# Altium project Smart Ring_2022.PrjPCB
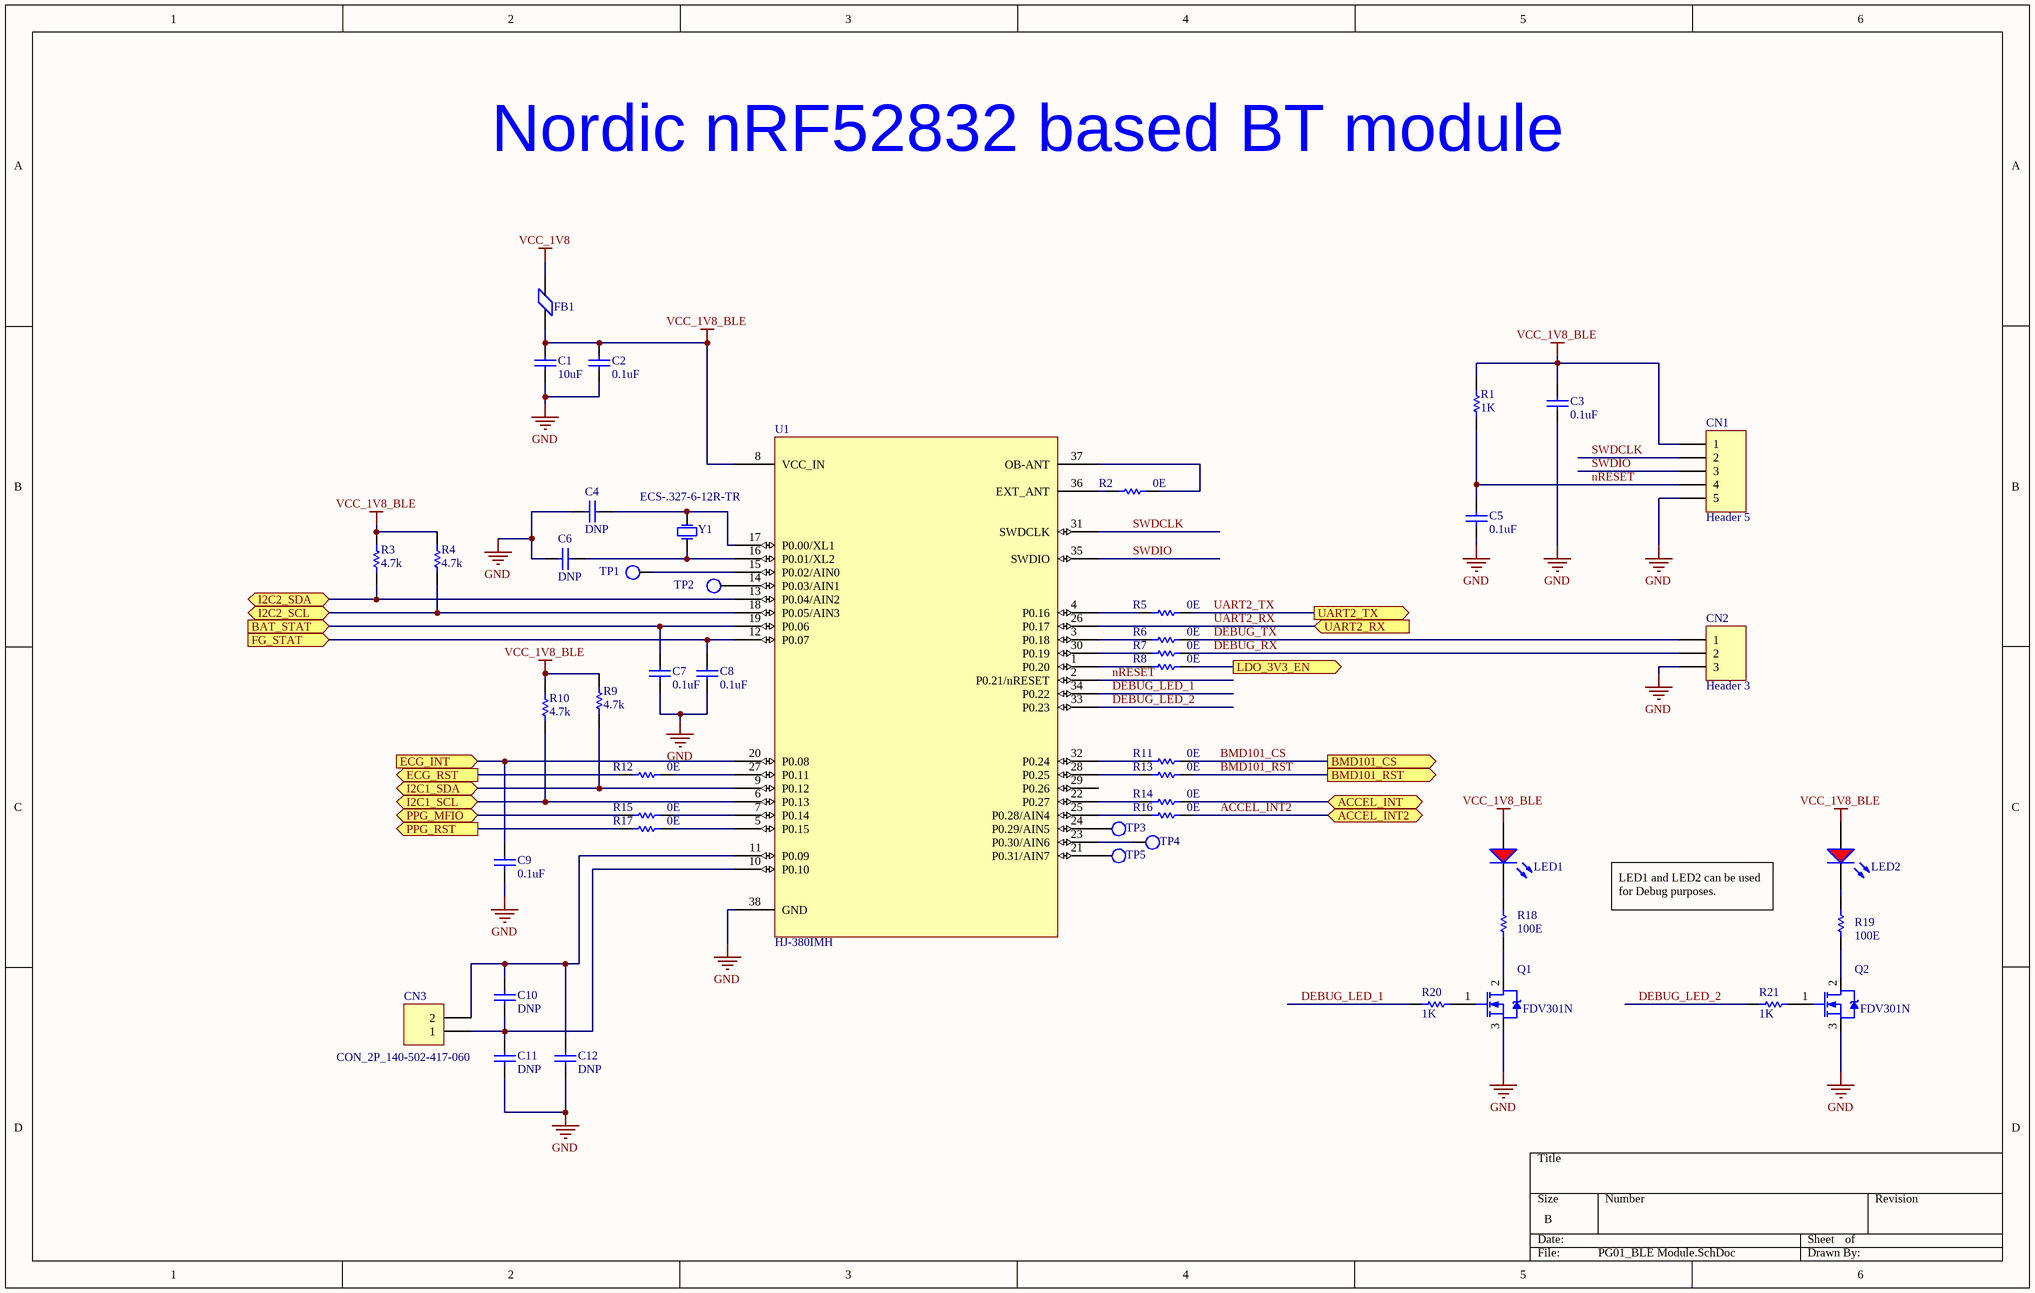
[diagram p0: PG01_BLE Module.SchDoc]
6 sheets, 221 parts. Net scope: flat (ports and power ports of the same name join across sheets).
Board file: PCB1_Bhavik.PcbDoc
Sheets:
  PG01_BLE Module.SchDoc
  PG02_PPG.SchDoc
  PG03_ECG.SchDoc
  PG04_Battery Charging.SchDoc
  PG05_Power Conversions.SchDoc
  PG06_Nuerosky.SchDoc

## Sheet PG01_BLE Module.SchDoc: Smart Ring (Concept)
size B; DocumentNumber: 1; SheetNumber: 1; SheetTotal: 3

### Parts
C1  10uF  [0805C]
C2  0.1uF  [0402C]
C3  0.1uF  [0402C]
C4  DNP  [0402C]
C5  0.1uF  [0402C]
C6  DNP  [0402C]
C7  0.1uF  [0402C]
C8  0.1uF  [0402C]
C9  0.1uF  [0402C]
C10  DNP  [0402C]
C11  DNP  [0402C]
C12  DNP  [0402C]
CN1  Header 5  [HDR1X5]
CN2  Header 3  [HDR1X3]
CN3  CON_2P_140-502-417-060  [140-502-417-060]
FB1  Ferrite Bead  [0402R]  (value not drawn)
LED1  5988A10107F  [0402R]  (value not drawn)
LED2  5988A10107F  [0402R]  (value not drawn)
Q1  FDV301N  [SOT_23]
Q2  FDV301N  [SOT_23]
R1  1K  [0402R]
R2  0E  [0402R]
R3  4.7k  [0402R]
R4  4.7k  [0402R]
R5  0E  [0402R]
R6  0E  [0402R]
R7  0E  [0402R]
R8  0E  [0402R]
R9  4.7k  [0402R]
R10  4.7k  [0402R]
R11  0E  [0402R]
R12  0E  [0402R]
R13  0E  [0402R]
R14  0E  [0402R]
R15  0E  [0402R]
R16  0E  [0402R]
R17  0E  [0402R]
R18  100E  [0402R]
R19  100E  [0402R]
R20  1K  [0402R]
R21  1K  [0402R]
TP1  Test_Point  [TP]  (value not drawn)
TP2  Test_Point  [TP]  (value not drawn)
TP3  Test_Point  [TP]  (value not drawn)
TP4  Test_Point  [TP]  (value not drawn)
TP5  Test_Point  [TP]  (value not drawn)
U1  HJ-380IMH  [HJ-380IMH]
Y1  ECS-.327-6-12R-TR  [ECS-.327-6-12R-TR]

### Ports
ACCEL_INT2 (bidir), ACCEL_INT (bidir), BAT_STAT (in), BMD101_CS (out), BMD101_RST (out), ECG_INT (in), ECG_RST (out), FG_STAT (in), I2C1_SCL (bidir), I2C1_SDA (bidir), I2C2_SCL (bidir), I2C2_SDA (bidir), LDO_3V3_EN (out), PPG_MFIO (bidir), PPG_RST (out), UART2_RX (in), UART2_TX (out)

### Nets
GND: C1.1 C2.1 C3.2 C4.2 C5.2 C6.2 C7.1 C8.1 C9.1 C11.1 C12.1 CN1.5 CN2.3 Q1.3(S) Q2.3(S) U1.38(GND)
VCC_1V8: FB1.2(VREF)
VCC_1V8_BLE: C1.2 C2.2 C3.1 CN1.1 FB1.1(VREF) LED1.1(A) LED2.1(A) R1.2 R3.2 R4.2 R9.2 R10.2 U1.8(VCC_IN)
ACCEL_INT: R14.2 ; port ACCEL_INT
ACCEL_INT2: R16.2 ; port ACCEL_INT2
BMD101_CS: R11.2 ; port BMD101_CS
BMD101_RST: R13.2 ; port BMD101_RST
DEBUG_LED_1: R20.1 U1.34(P0.22)
DEBUG_LED_2: R21.1 U1.33(P0.23)
DEBUG_RX: CN2.2 R7.2
DEBUG_TX: CN2.1 R6.2
nRESET: C5.1 CN1.4 R1.1 U1.2(P0.21/nRESET)
SWDCLK: CN1.2 U1.31(SWDCLK)
SWDIO: CN1.3 U1.35(SWDIO)
UART2_RX: U1.26(P0.17) ; port UART2_RX
UART2_TX: R5.2 ; port UART2_TX
NetC4_1: C4.1 U1.17(P0.00/XL1) Y1.2(OSC2)
NetC6_1: C6.1 U1.16(P0.01/XL2) Y1.1(OSC1)
NetC7_2: C7.2 U1.19(P0.06) ; port BAT_STAT
NetC8_2: C8.2 U1.12(P0.07) ; port FG_STAT
NetC9_2: C9.2 U1.20(P0.08) ; port ECG_INT
NetC10_1: C10.1 C11.2 CN3.1 U1.10(P0.10)
NetC10_2: C10.2 C12.2 CN3.2 U1.11(P0.09)
NetC23_2: R17.1 ; port PPG_RST
NetC24_2: R15.1 ; port PPG_MFIO
NetC45_2: R12.1 ; port ECG_RST
NetLED1_2: LED1.2(K) R18.2
NetLED2_2: LED2.2(K) R19.2
NetQ1_1: Q1.1(G) R20.2
NetQ1_2: Q1.2(D) R18.1
NetQ2_1: Q2.1(G) R21.2
NetQ2_2: Q2.2(D) R19.1
NetR2_1: R2.1 U1.36(EXT_ANT)
NetR2_2: R2.2 U1.37(OB-ANT)
NetR3_1: R3.1 U1.13(P0.04/AIN2) ; port I2C2_SDA
NetR4_1: R4.1 U1.18(P0.05/AIN3) ; port I2C2_SCL
NetR5_1: R5.1 U1.4(P0.16)
NetR6_1: R6.1 U1.3(P0.18)
NetR7_1: R7.1 U1.30(P0.19)
NetR8_1: R8.1 U1.1(P0.20)
NetR8_2: R8.2 ; port LDO_3V3_EN
NetR9_1: R9.1 U1.9(P0.12) ; port I2C1_SDA
NetR10_1: R10.1 U1.6(P0.13) ; port I2C1_SCL
NetR11_1: R11.1 U1.32(P0.24)
NetR12_2: R12.2 U1.27(P0.11)
NetR13_1: R13.1 U1.28(P0.25)
NetR14_1: R14.1 U1.22(P0.27)
NetR15_2: R15.2 U1.7(P0.14)
NetR16_1: R16.1 U1.25(P0.28/AIN4)
NetR17_2: R17.2 U1.5(P0.15)
NetTP1_1: TP1.1 U1.15(P0.02/AIN0)
NetTP2_1: TP2.1 U1.14(P0.03/AIN1)
NetTP3_1: TP3.1 U1.24(P0.29/AIN5)
NetTP4_1: TP4.1 U1.23(P0.30/AIN6)
NetTP5_1: TP5.1 U1.21(P0.31/AIN7)

Not connected (* = marked no-connect by the designer): U1 29(P0.26)

### Notes on the sheet
- Nordic nRF52832 based BT module
- LED1 and LED2 can be used for Debug purposes.

### Library data of the parts
C1 = CAP_0805_10uF_16V: CAP CER 10UF 16V X7R 0805; Alternate MFR: Taiyo Yuden; Alternate MPN: EMK212BB7106MG-T; Package: 0805; Value: 10uF
C2 C3 C5 C7-C9 = CAP_0402_0.1uF_50V: CAP CER 0.1UF 50V X7R 0402; Alternate MFR: Samsung Electro-Mechanics; Alternate MPN: CL05B104KB54PNC; Package: 0402; Value: 0.1uF
C4 C6 C10-C12 = CAP_0402_DNP: CAP CER DNP 0402; MFR: Generic; MPN: Generic; Package: 0402; Value: DNP
CN1 = CON_5P_CI0105M1HR0-NH: 5 POS 2.00MM(.079) SINGLE ROW SM; MFR: Cvilux USA; MPN: CI0105M1HR0-NH
CN2 = CON_3P_CI0103M1HR0-NH: 3 POS 2.00MM(.079) SINGLE ROW SM; MFR: Cvilux USA; MPN: CI0103M1HR0-NH
CN3 = CON_2P_140-502-417-060: 2.0MM PITCH CONNECTOR WITH 2 SUR; MFR: EDAC Inc.; MPN: 140-502-417-060
FB1 = Ferrite Bead: CHIP BEAD 600 OHM 0402 300mA; MFR: Walsin; MPN: WLBD1005K2U601TP; Package: 0402
LED1 LED2 = LED_Red: Red LED; MFR: Dialight; Forward Voltage: 1.6V; Value: Red; Package: 0402; MPN: 5988A10107F
Q1 Q2 = NMOS_FDV301N: MOSFET N-CH 25V 220MA SOT23; MFR: onsemi; ComponentLink1Description: Manufacturer Link; ComponentLink1URL: http://www.irf.com/; MPN: FDV301N; Package: SOT23
R1 R20 R21 = RES_0402_1k: RES SMD 1K OHM 1% 1/16W 0402; MFR: Generic; Alternate MFR: YAGEO; Alternate MPN: AC0402FR-071KL; MPN: Generic; Package: 0402; Value: 1K
R2 R5-R8 R11-R17 = RES_0402_0E: RES 0 OHM JUMPER 1/16W 0402; MFR: Generic; Alternate MFR: YAGEO; Alternate MPN: AC0402JR-130RL; MPN: Generic; Package: 0402; Value: 0E
R3 R4 R9 R10 = RES_0402_4.7k: RES 4.7K OHM 1% 1/16W 0402; MFR: Generic; Alternate MFR: YAGEO; Alternate MPN: RC0402FR-134K7L; MPN: Generic; Package: 0402; Value: 4.7k
R18 R19 = RES_0402_100E: RES 100 OHM 1% 1/16W 0402; MFR: Generic; Alternate MFR: YAGEO; Alternate MPN: RC0402FR-13100RL; MPN: Generic; Package: 0402; Value: 100E
U1 = BLE Module_HJ-380IMH: Chip-scale high performance ultra small (5.5mmX6mm) ultra low power / Bluetooth 5.0 module based on Nordic nRF52832; MFR: TangShan HongJia Electronic Technology Co., Ltd; MPN: HJ-380IMH
Y1 = XTAL_32.768kHz: CRYSTAL 32.7680KHZ 6PF SMD; MFR: ECS Inc.; MPN: ECS-.327-6-12R-TR; Capacitance: 6pF; Value: 32.768kHz

## Sheet PG02_PPG.SchDoc: Smart Ring (Concept)
size B; DocumentNumber: 2; Revision: A; SheetNumber: 2; SheetTotal: 3
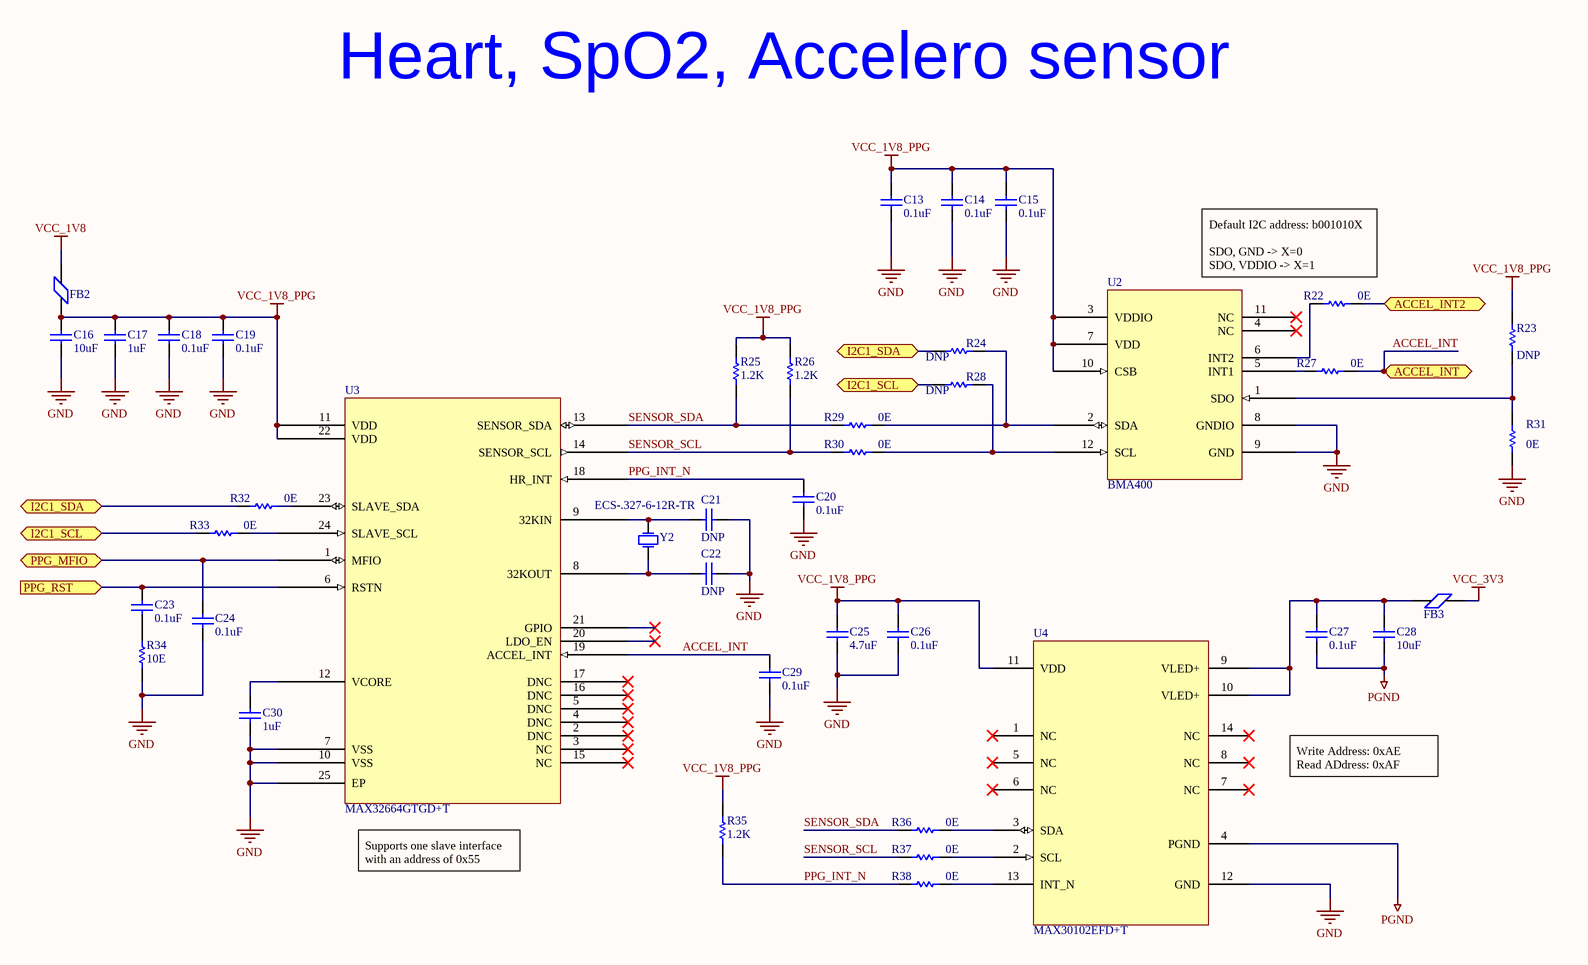
[diagram p1: PG02_PPG.SchDoc]

### Parts
C13  0.1uF  [0402C]
C14  0.1uF  [0402C]
C15  0.1uF  [0402C]
C16  10uF  [0805C]
C17  1uF  [0805C]
C18  0.1uF  [0402C]
C19  0.1uF  [0402C]
C20  0.1uF  [0402C]
C21  DNP  [0402C]
C22  DNP  [0402C]
C23  0.1uF  [0402C]
C24  0.1uF  [0402C]
C25  4.7uF  [0805C]
C26  0.1uF  [0402C]
C27  0.1uF  [0402C]
C28  10uF  [0805C]
C29  0.1uF  [0402C]
C30  1uF  [0805C]
FB2  Ferrite Bead  [0402R]  (value not drawn)
FB3  Ferrite Bead  [0402R]  (value not drawn)
R22  0E  [0402R]
R23  DNP  [0402C]
R24  DNP  [0402C]
R25  1.2K  [0402R]
R26  1.2K  [0402R]
R27  0E  [0402R]
R28  DNP  [0402C]
R29  0E  [0402R]
R30  0E  [0402R]
R31  0E  [0402R]
R32  0E  [0402R]
R33  0E  [0402R]
R34  10E  [0402R]
R35  1.2K  [0402R]
R36  0E  [0402R]
R37  0E  [0402R]
R38  0E  [0402R]
U2  BMA400  [BMA400]
U3  MAX32664GTGD+T  [MAX32664GTGA+T]
U4  MAX30102EFD+T  [MAX30101EFD+T]
Y2  ECS-.327-6-12R-TR  [ECS-.327-6-12R-TR]

### Ports
ACCEL_INT2 (bidir), ACCEL_INT (bidir), I2C1_SCL (bidir), I2C1_SDA (bidir), PPG_MFIO (bidir), PPG_RST (in)

### Nets
GND: C13.1 C14.1 C15.1 C16.1 C17.1 C18.1 C19.1 C20.1 C21.1 C22.1 C24.1 C25.1 C26.1 C29.1 C30.1 R31.1 R34.1 U2.8(GNDIO) U2.9(GND) U3.7(VSS) U3.10(VSS) U3.25(EP) U4.12(GND)
PGND: C27.1 C28.1 U4.4(PGND)
VCC_1V8: FB2.2(VREF)
VCC_1V8_PPG: C13.2 C14.2 C15.2 C16.2 C17.2 C18.2 C19.2 C25.2 C26.2 FB2.1(VREF) R23.2 R25.2 R26.2 R35.2 U2.3(VDDIO) U2.7(VDD) U2.10(CSB) U3.11(VDD) U3.22(VDD) U4.11(VDD)
VCC_3V3: FB3.2(VREF)
ACCEL_INT: C29.2 R27.2 U3.19(ACCEL_INT) ; port ACCEL_INT
ACCEL_INT2: R22.2 ; port ACCEL_INT2
PPG_INT_N: C20.2 R35.1 R38.1 U3.18(HR_INT)
SENSOR_SCL: R26.1 R30.1 R37.1 U3.14(SENSOR_SCL)
SENSOR_SDA: R25.1 R29.1 R36.1 U3.13(SENSOR_SDA)
NetC21_2: C21.2 U3.9(32KIN) Y2.2(OSC2)
NetC22_2: C22.2 U3.8(32KOUT) Y2.1(OSC1)
NetC23_1: C23.1 R34.2
NetC23_2: C23.2 U3.6(RSTN) ; port PPG_RST
NetC24_2: C24.2 U3.1(MFIO) ; port PPG_MFIO
NetC27_2: C27.2 C28.2 FB3.1(VREF) U4.9(VLED+) U4.10(VLED+)
NetC30_2: C30.2 U3.12(VCORE)
NetR9_1: R24.2 R32.1 ; port I2C1_SDA
NetR10_1: R28.2 R33.1 ; port I2C1_SCL
NetR22_1: R22.1 U2.6(INT2)
NetR23_1: R23.1 R31.2 U2.1(SDO)
NetR24_1: R24.1 R29.2 U2.2(SDA)
NetR27_1: R27.1 U2.5(INT1)
NetR28_1: R28.1 R30.2 U2.12(SCL)
NetR32_2: R32.2 U3.23(SLAVE_SDA)
NetR33_2: R33.2 U3.24(SLAVE_SCL)
NetR36_2: R36.2 U4.3(SDA)
NetR37_2: R37.2 U4.2(SCL)
NetR38_2: R38.2 U4.13(INT_N)

Not connected (* = marked no-connect by the designer): U2 4(NC)* 11(NC)*; U3 2(DNC)* 3(NC)* 4(DNC)* 5(DNC)* 15(NC)* 16(DNC)* 17(DNC)* 20(LDO_EN)* 21(GPIO)*; U4 1(NC)* 5(NC)* 6(NC)* 7(NC)* 8(NC)* 14(NC)*

### Notes on the sheet
- Heart, SpO2, Accelero sensor
- Default I2C address: b001010X
  SDO, GND -> X=0
  SDO, VDDIO -> X=1
- Write Address: 0xAE
  Read ADdress: 0xAF
- (near U3) Supports one slave interface with an address of 0x55

### Library data of the parts
C13-C15 C18-C20 C23 C24 C26 C27 C29 = CAP_0402_0.1uF_50V: as C2 on sheet PG01_BLE Module; Package: 0402; Value: 0.1uF
C16 C28 = CAP_0805_10uF_16V: as C1 on sheet PG01_BLE Module; Package: 0805; Value: 10uF
C17 C30 = CAP_0805_1uF_25V: CAP CER 1UF 25V X7R 0805; Alternate MFR: Würth Elektronik; Alternate MPN: 885012207078; Package: 0805; Value: 1uF
C21 C22 = CAP_0402_DNP: CAP CER DNP 0402; MFR: Generic; MPN: Generic; Package: 0402; Value: DNP
C25 = CAP_0805_4.7uF_16V: CAP CER MLCC 4.7uF X7R 16V  0805; Alternate MFR: Murata Electronics; Alternate MPN: GRM21BR71C475ME51K; Package: 0805; Value: 4.7uF
FB2 FB3 = Ferrite Bead: as FB1 on sheet PG01_BLE Module; Package: 0402
R22 R27 R29-R33 R36-R38 = RES_0402_0E: as R2 on sheet PG01_BLE Module; MPN: Generic; Package: 0402; Value: 0E
R23 R24 R28 = RES_0402_DNP: RES DNP 0402; Package: 0402; Value: DNP
R25 R26 R35 = RES_0402_1.2k: RES 1.2K OHM 1% 1/16W 0402; MFR: Generic; Alternate MFR: YAGEO; Alternate MPN: RC0402FR-071K2L; MPN: Generic; Package: 0402; Value: 1.2K
R34 = RES_0402_10E: RES 10 OHM 1% 1/16W 0402; MFR: Generic; Alternate MFR: YAGEO; Alternate MPN: RC0402FR-1310RL; MPN: Generic; Package: 0402; Value: 10E
U2 = AccSensor_BMA400: ACCELEROMETER 2-16G 12LGA; MFR: Bosch; Value: BMA400; MPN: BMA400
U3 = MAX32664GTGD+T: Biometric Sensors CORTEX M4F 96MHZ ME11, TQFN 3X3; MFR: Maxim Integrated; MPN: MAX32664GTGD+T; Package: 24-TQFN (3x3)
U4 = MAX30101EFD+T: Biometric Sensors Oximeter/Heart Rate Integrated Optical Sensor; MFR: Maxim Integrated; Value: 14 OESIP; MPN: MAX30102EFD+T
Y2 = XTAL_32.768kHz: as Y1 on sheet PG01_BLE Module; MPN: ECS-.327-6-12R-TR; Capacitance: 6pF; Value: 32.768kHz

## Sheet PG03_ECG.SchDoc: Smart Ring (Concept)
size B; DocumentNumber: 3; SheetNumber: 3; SheetTotal: 3
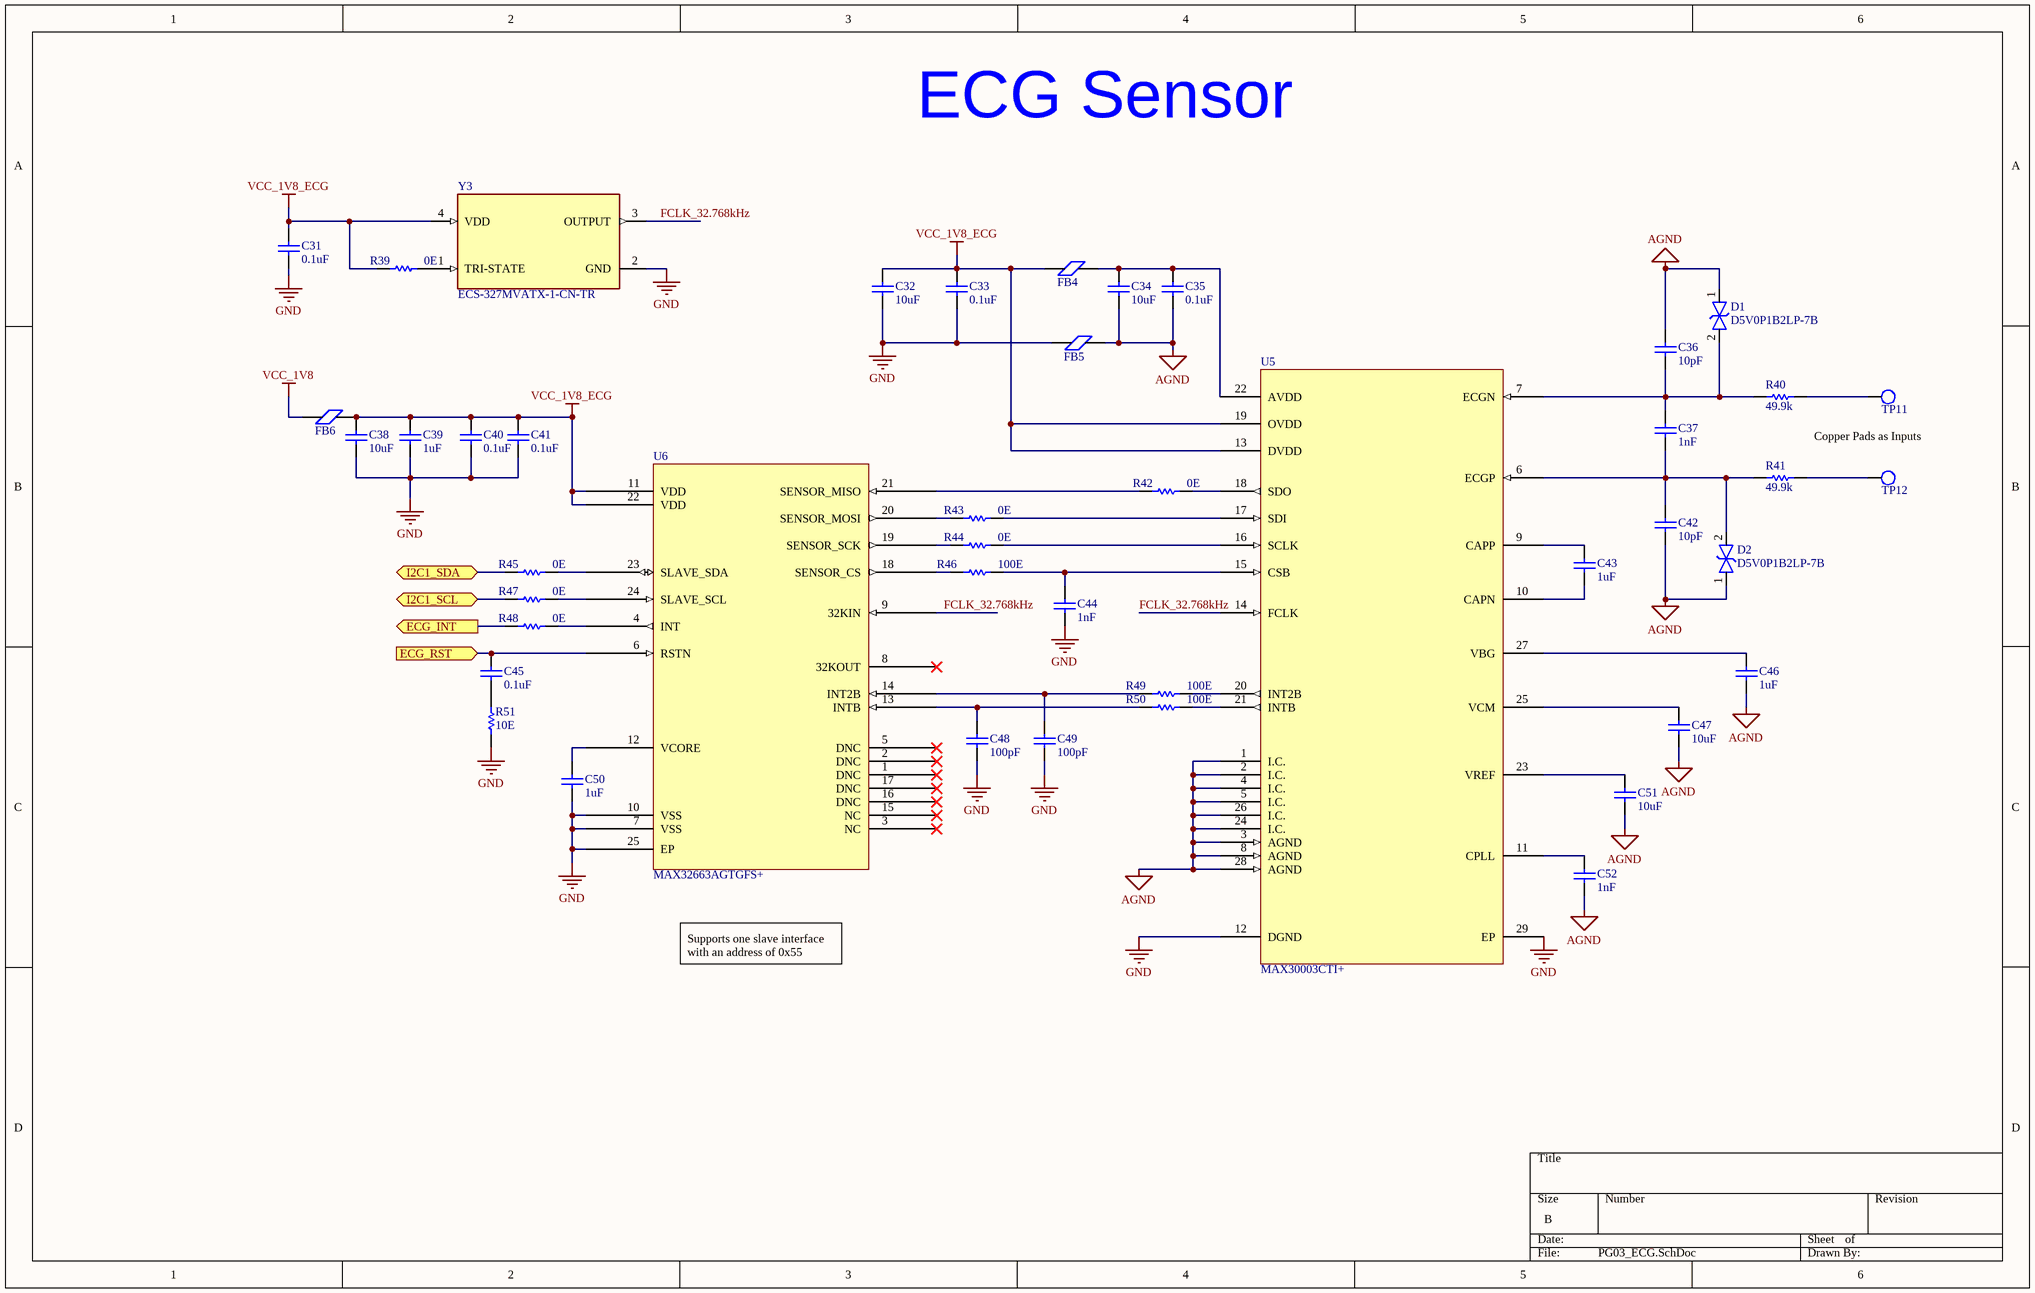
[diagram p2: PG03_ECG.SchDoc]

### Parts
C31  0.1uF  [0402C]
C32  10uF  [0805C]
C33  0.1uF  [0402C]
C34  10uF  [0805C]
C35  0.1uF  [0402C]
C36  10pF  [0402C]
C37  1nF  [0402C]
C38  10uF  [0805C]
C39  1uF  [0805C]
C40  0.1uF  [0402C]
C41  0.1uF  [0402C]
C42  10pF  [0402C]
C43  1uF  [0805C]
C44  1nF  [0402C]
C45  0.1uF  [0402C]
C46  1uF  [0805C]
C47  10uF  [0805C]
C48  100pF  [0402C]
C49  100pF  [0402C]
C50  1uF  [0805C]
C51  10uF  [0805C]
C52  1nF  [0402C]
D1  D5V0P1B2LP-7B  [D5V0P1B2LP-7B]
D2  D5V0P1B2LP-7B  [D5V0P1B2LP-7B]
FB4  Ferrite Bead  [0402R]  (value not drawn)
FB5  Ferrite Bead  [0402R]  (value not drawn)
FB6  Ferrite Bead  [0402R]  (value not drawn)
R39  0E  [0402R]
R40  49.9k  [0402R]
R41  49.9k  [0402R]
R42  0E  [0402R]
R43  0E  [0402R]
R44  0E  [0402R]
R45  0E  [0402R]
R46  100E  [0402R]
R47  0E  [0402R]
R48  0E  [0402R]
R49  100E  [0402R]
R50  100E  [0402R]
R51  10E  [0402R]
TP11  Test_Point  [TP_SMD]  (value not drawn)
TP12  Test_Point  [TP_SMD]  (value not drawn)
U5  MAX30003CTI+  [MAX30003CTI+]
U6  MAX32663AGTGFS+  [MAX32663AGTGFS+]
Y3  ECS-327MVATX-1-CN-TR  [ECS-327MVATX-1-CN-TR]

### Ports
ECG_INT (out), ECG_RST (in), I2C1_SCL (bidir), I2C1_SDA (bidir)

### Nets
AGND: C34.1 C35.1 C36.2 C42.1 C46.1 C47.1 C51.1 C52.1 D1.1 D2.1 FB5.2(VREF) U5.1(I.C.) U5.2(I.C.) U5.3(AGND) U5.4(I.C.) U5.5(I.C.) U5.8(AGND) U5.24(I.C.) U5.26(I.C.) U5.28(AGND)
GND: C31.1 C32.1 C33.1 C38.1 C39.1 C40.1 C41.1 C44.1 C48.1 C49.1 C50.1 FB5.1(VREF) R51.1 U5.12(DGND) U5.29(EP) U6.7(VSS) U6.10(VSS) U6.25(EP) Y3.2(GND)
VCC_1V8: FB6.2(VREF)
VCC_1V8_ECG: C31.2 C32.2 C33.2 C38.2 C39.2 C40.2 C41.2 FB4.2(VREF) FB6.1(VREF) R39.1 U5.13(DVDD) U5.19(OVDD) U6.11(VDD) U6.22(VDD) Y3.4(VDD)
FCLK_32.768kHz: U5.14(FCLK) U6.9(32KIN) Y3.3(OUTPUT)
NetC9_2: R48.1 ; port ECG_INT
NetC34_2: C34.2 C35.2 FB4.1(VREF) U5.22(AVDD)
NetC36_1: C36.1 C37.2 D1.2 R40.1 U5.7(ECGN)
NetC37_1: C37.1 C42.2 D2.2 R41.1 U5.6(ECGP)
NetC43_1: C43.1 U5.10(CAPN)
NetC43_2: C43.2 U5.9(CAPP)
NetC44_2: C44.2 R46.2 U5.15(CSB)
NetC45_1: C45.1 R51.2
NetC45_2: C45.2 U6.6(RSTN) ; port ECG_RST
NetC46_2: C46.2 U5.27(VBG)
NetC47_2: C47.2 U5.25(VCM)
NetC48_2: C48.2 R50.1 U6.13(INTB)
NetC49_2: C49.2 R49.1 U6.14(INT2B)
NetC50_2: C50.2 U6.12(VCORE)
NetC51_2: C51.2 U5.23(VREF)
NetC52_2: C52.2 U5.11(CPLL)
NetR9_1: R45.1 ; port I2C1_SDA
NetR10_1: R47.1 ; port I2C1_SCL
NetR39_2: R39.2 Y3.1(TRI-STATE)
NetR40_2: R40.2 TP11.1
NetR41_2: R41.2 TP12.1
NetR42_1: R42.1 U6.21(SENSOR_MISO)
NetR42_2: R42.2 U5.18(SDO)
NetR43_1: R43.1 U6.20(SENSOR_MOSI)
NetR43_2: R43.2 U5.17(SDI)
NetR44_1: R44.1 U6.19(SENSOR_SCK)
NetR44_2: R44.2 U5.16(SCLK)
NetR45_2: R45.2 U6.23(SLAVE_SDA)
NetR46_1: R46.1 U6.18(SENSOR_CS)
NetR47_2: R47.2 U6.24(SLAVE_SCL)
NetR48_2: R48.2 U6.4(INT)
NetR49_2: R49.2 U5.20(INT2B)
NetR50_2: R50.2 U5.21(INTB)

Not connected (* = marked no-connect by the designer): U6 1(DNC)* 2(DNC)* 3(NC)* 5(DNC)* 8(32KOUT)* 15(NC)* 16(DNC)* 17(DNC)*

### Notes on the sheet
- ECG Sensor
- Copper Pads as Inputs
- Supports one slave interface with an address of 0x55

### Library data of the parts
C31 C33 C35 C40 C41 C45 = CAP_0402_0.1uF_50V: as C2 on sheet PG01_BLE Module; Package: 0402; Value: 0.1uF
C32 C34 C38 C47 C51 = CAP_0805_10uF_16V: as C1 on sheet PG01_BLE Module; Package: 0805; Value: 10uF
C36 C42 = CAP_0402_10pF_50V: CAP CER 10PF 50V C0G/NP0 0402; Alternate MFR: Murata Electronics; Alternate MPN: GRT1555C1H100JA02J; Package: 0402; Value: 10pF
C37 C44 C52 = CAP_0402_1nF_50V: CAP CER 1000PF 50V X7R 0402; Alternate MFR: TDK Corporation; Alternate MPN: C1005X7R1H102K050BA; Package: 0402; Value: 1nF
C39 C43 C46 C50 = CAP_0805_1uF_25V: as C17 on sheet PG02_PPG; Package: 0805; Value: 1uF
C48 C49 = CAP_0402_100pF_50V: CAP CER 100PF 50V C0G 0402; Alternate MFR: TDK Corporation; Alternate MPN: C1005C0G1H101J050BA; Package: 0402; Value: 100pF
D1 D2 = TVS_D5V0P1B2LP-7B: TVS DIODE 5.5VWM 13VC DFN1006-2; MFR: Diodes Incorporated; MPN: D5V0P1B2LP-7B; Package: X1-DFN1006-2
FB4-FB6 = Ferrite Bead: as FB1 on sheet PG01_BLE Module; Package: 0402
R39 R42-R45 R47 R48 = RES_0402_0E: as R2 on sheet PG01_BLE Module; MPN: Generic; Package: 0402; Value: 0E
R40 R41 = RES_0402_49.9k: RES 49.9K OHM 1% 1/16W 0402; MFR: Generic; Alternate MFR: YAGEO; Alternate MPN: RC0402FR-0749K9L; MPN: Generic; Package: 0402; Value: 49.9k
R46 R49 R50 = RES_0402_100E: as R18 on sheet PG01_BLE Module; MPN: Generic; Package: 0402; Value: 100E
R51 = RES_0402_10E: as R34 on sheet PG02_PPG; MPN: Generic; Package: 0402; Value: 10E
TP11 TP12 = Test_Point_1
U5 = MAX30003CTI+: Analog Front End - AFE Bio Potential AFE; MFR: Maxim Integrated; MPN: MAX30003CTI+; Package: 28-TQFN (5X5)
U6 = MAX32663AGTGFS+: SENSOR HUB W/ B-SECUR'S FULL HEA; MFR: Maxim Integrated; MPN: MAX32663AGTGFS+; Package: 24-TQFN (3x3)
Y3 = OSC_32.768kHz: XTAL OSC XO 32.768KHZ SMD; MFR: ECS Inc.; MPN: ECS-327MVATX-1-CN-TR; Package: 4-SMD, No Lead; Value: *

## Sheet PG04_Battery Charging.SchDoc: Smart Ring (Concept)
size B; Revision: 0.1
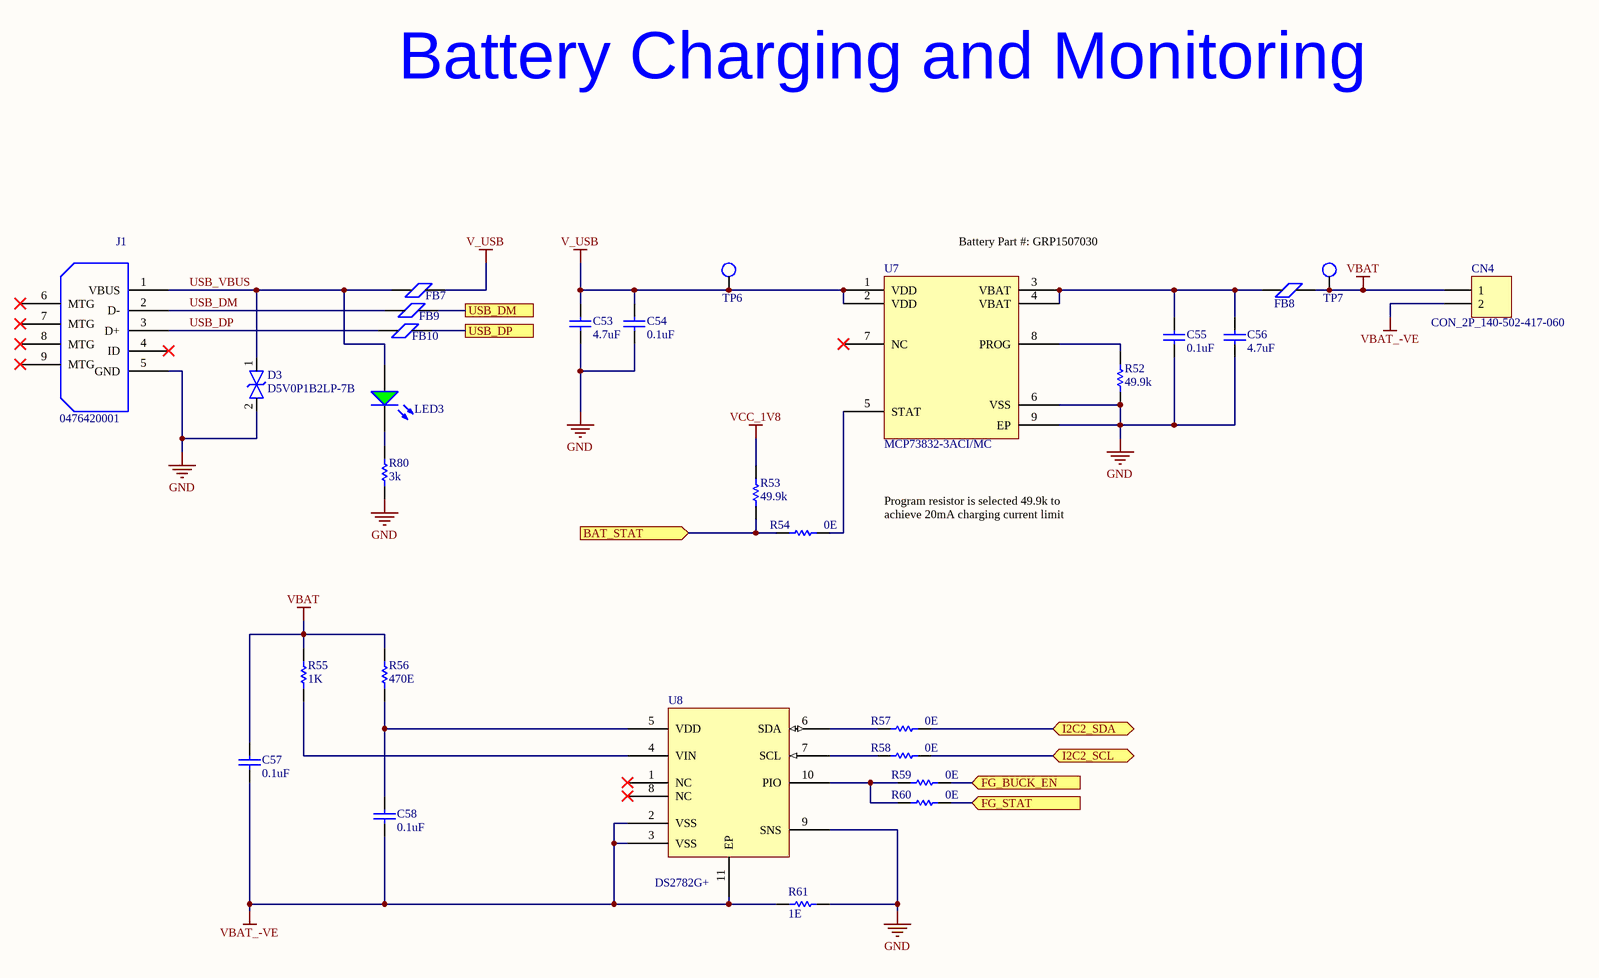
[diagram p3: PG04_Battery Charging.SchDoc]

### Parts
C53  4.7uF  [0805C]
C54  0.1uF  [0402C]
C55  0.1uF  [0402C]
C56  4.7uF  [0805C]
C57  0.1uF  [0402C]
C58  0.1uF  [0402C]
CN4  CON_2P_140-502-417-060  [140-502-417-060]
D3  D5V0P1B2LP-7B  [D5V0P1B2LP-7B]
FB7  Ferrite Bead  [0402R]  (value not drawn)
FB8  Ferrite Bead  [0402R]  (value not drawn)
FB9  Ferrite Bead  [0402R]  (value not drawn)
FB10  Ferrite Bead  [0402R]  (value not drawn)
J1  0476420001  [MOLEX_476420001]
LED3  LED_Green  [0402R]  (value not drawn)
R52  49.9k  [0402R]
R53  49.9k  [0402R]
R54  0E  [0402R]
R55  1K  [0402R]
R56  470E  [0402R]
R57  0E  [0402R]
R58  0E  [0402R]
R59  0E  [0402R]
R60  0E  [0402R]
R61  1E  [0402R]
R80  3k  [0402R]
TP6  Test_Point  [TP]  (value not drawn)
TP7  Test_Point  [TP]  (value not drawn)
U7  Battery Charger_MCP73832  [MCP73832-3ACI/MC]  (value not drawn)
U8  DS2782G+  [DS2782G+]

### Ports
BAT_STAT (in), FG_BUCK_EN (in), FG_STAT (in), I2C2_SCL (bidir), I2C2_SDA (bidir), USB_DM, USB_DP

### Nets
GND: C53.1 C54.1 C55.1 C56.1 D3.2 J1.5(GND) R52.1 R61.2 R80.1 U7.6(VSS) U7.9(EP) U8.9(SNS)
V_USB: C53.2 C54.2 FB7.2(VREF) TP6.1 U7.1(VDD) U7.2(VDD)
VBAT: C57.2 CN4.1 FB8.2(VREF) R55.2 R56.2 TP7.1
VBAT_-VE: C57.1 C58.1 CN4.2 R61.1 U8.2(VSS) U8.3(VSS) U8.11(EP)
VCC_1V8: R53.2
USB_DM: FB9.1(VREF) J1.2(D-)
USB_DP: FB10.1(VREF) J1.3(D+)
USB_VBUS: D3.1 FB7.1(VREF) J1.1(VBUS) LED3.1(A)
NetC7_2: R53.1 R54.1 ; port BAT_STAT
NetC8_2: R60.2 ; port FG_STAT
NetC55_2: C55.2 C56.2 FB8.1(VREF) U7.3(VBAT) U7.4(VBAT)
NetC58_2: C58.2 R56.1 U8.5(VDD)
NetFB9_2: FB9.2(VREF) ; port USB_DM
NetFB10_2: FB10.2(VREF) ; port USB_DP
NetLED3_2: LED3.2(K) R80.2
NetR3_1: R57.2 ; port I2C2_SDA
NetR4_1: R58.2 ; port I2C2_SCL
NetR52_2: R52.2 U7.8(PROG)
NetR54_2: R54.2 U7.5(STAT)
NetR55_1: R55.1 U8.4(VIN)
NetR57_1: R57.1 U8.6(SDA)
NetR58_1: R58.1 U8.7(SCL)
NetR59_1: R59.1 R60.1 U8.10(PIO)
NetR59_2: R59.2 ; port FG_BUCK_EN

Not connected (* = marked no-connect by the designer): J1 4(ID)* 6(MTG)* 7(MTG)* 8(MTG)* 9(MTG)*; U7 7(NC)*; U8 1(NC)* 8(NC)*

### Notes on the sheet
- Battery Charging and Monitoring
- (near U7) Battery Part #: GRP1507030
- Program resistor is selected 49.9k to achieve 20mA charging current limit

### Library data of the parts
C53 C56 = CAP_0805_4.7uF_16V: as C25 on sheet PG02_PPG; Package: 0805; Value: 4.7uF
C54 C55 C57 C58 = CAP_0402_0.1uF_50V: as C2 on sheet PG01_BLE Module; Package: 0402; Value: 0.1uF
CN4 = CON_2P_140-502-417-060: as CN3 on sheet PG01_BLE Module; MPN: 140-502-417-060
D3 = TVS_D5V0P1B2LP-7B: as D1 on sheet PG03_ECG; MPN: D5V0P1B2LP-7B; Package: X1-DFN1006-2
FB7-FB10 = Ferrite Bead: as FB1 on sheet PG01_BLE Module; Package: 0402
J1 = Micro_USB_0476420001: CONN RCPT MICRO USB B 5POS SMD; Alternate MFR: Molex; Alternate MPN: 0476420001
LED3 = LED_Green: Red LED; MFR: Kingbright; Alternate MFR: Lite-On; Alternate MPN: LTST-C281KGKT; MPN: APG1005CGC-T; Value: Green; Forward Voltage: 2V; Package: 0402
R52 R53 = RES_0402_49.9k: as R40 on sheet PG03_ECG; MPN: Generic; Package: 0402; Value: 49.9k
R54 R57-R60 = RES_0402_0E: as R2 on sheet PG01_BLE Module; MPN: Generic; Package: 0402; Value: 0E
R55 = RES_0402_1k: as R1 on sheet PG01_BLE Module; MPN: Generic; Package: 0402; Value: 1K
R56 = RES_0402_470E: RES 470 OHM 1% 1/16W 0402; MFR: Generic; Alternate MFR: YAGEO; Alternate MPN: RC0402FR-07470RL; MPN: Generic; Package: 0402; Value: 470E
R61 = RES_0402_1E: RES 1 OHM 1% 1/16W 0402; MFR: Generic; Alternate MFR: YAGEO; Alternate MPN: RC0402FR-071RL; MPN: Generic; Package: 0402; Value: 1E
R80 = RES_0402_3k: RES SMD 3K OHM 0.1% 1/16W 0402; MFR: Vishay; MPN: MCS04020D3001BE000; Alternate MFR: Panasonic; Alternate MPN: ERA-2ARB302X; Package: 0402; Value: 3k
U7 = Battery Charger_MCP73832: IC BATT CONTRL LI-ION 1CELL 8DFN; MFR: Microchip; MPN: MCP73832-3ACI/MC; Package: 8-DFN (2x3)
U8 = DS2782G+: IC BATT MON LI-ION 1CELL 10TDFN; MFR: Maxim Integrated; MPN: DS2782G+; Package: 10-TDFN (3x4)

## Sheet PG05_Power Conversions.SchDoc
size B
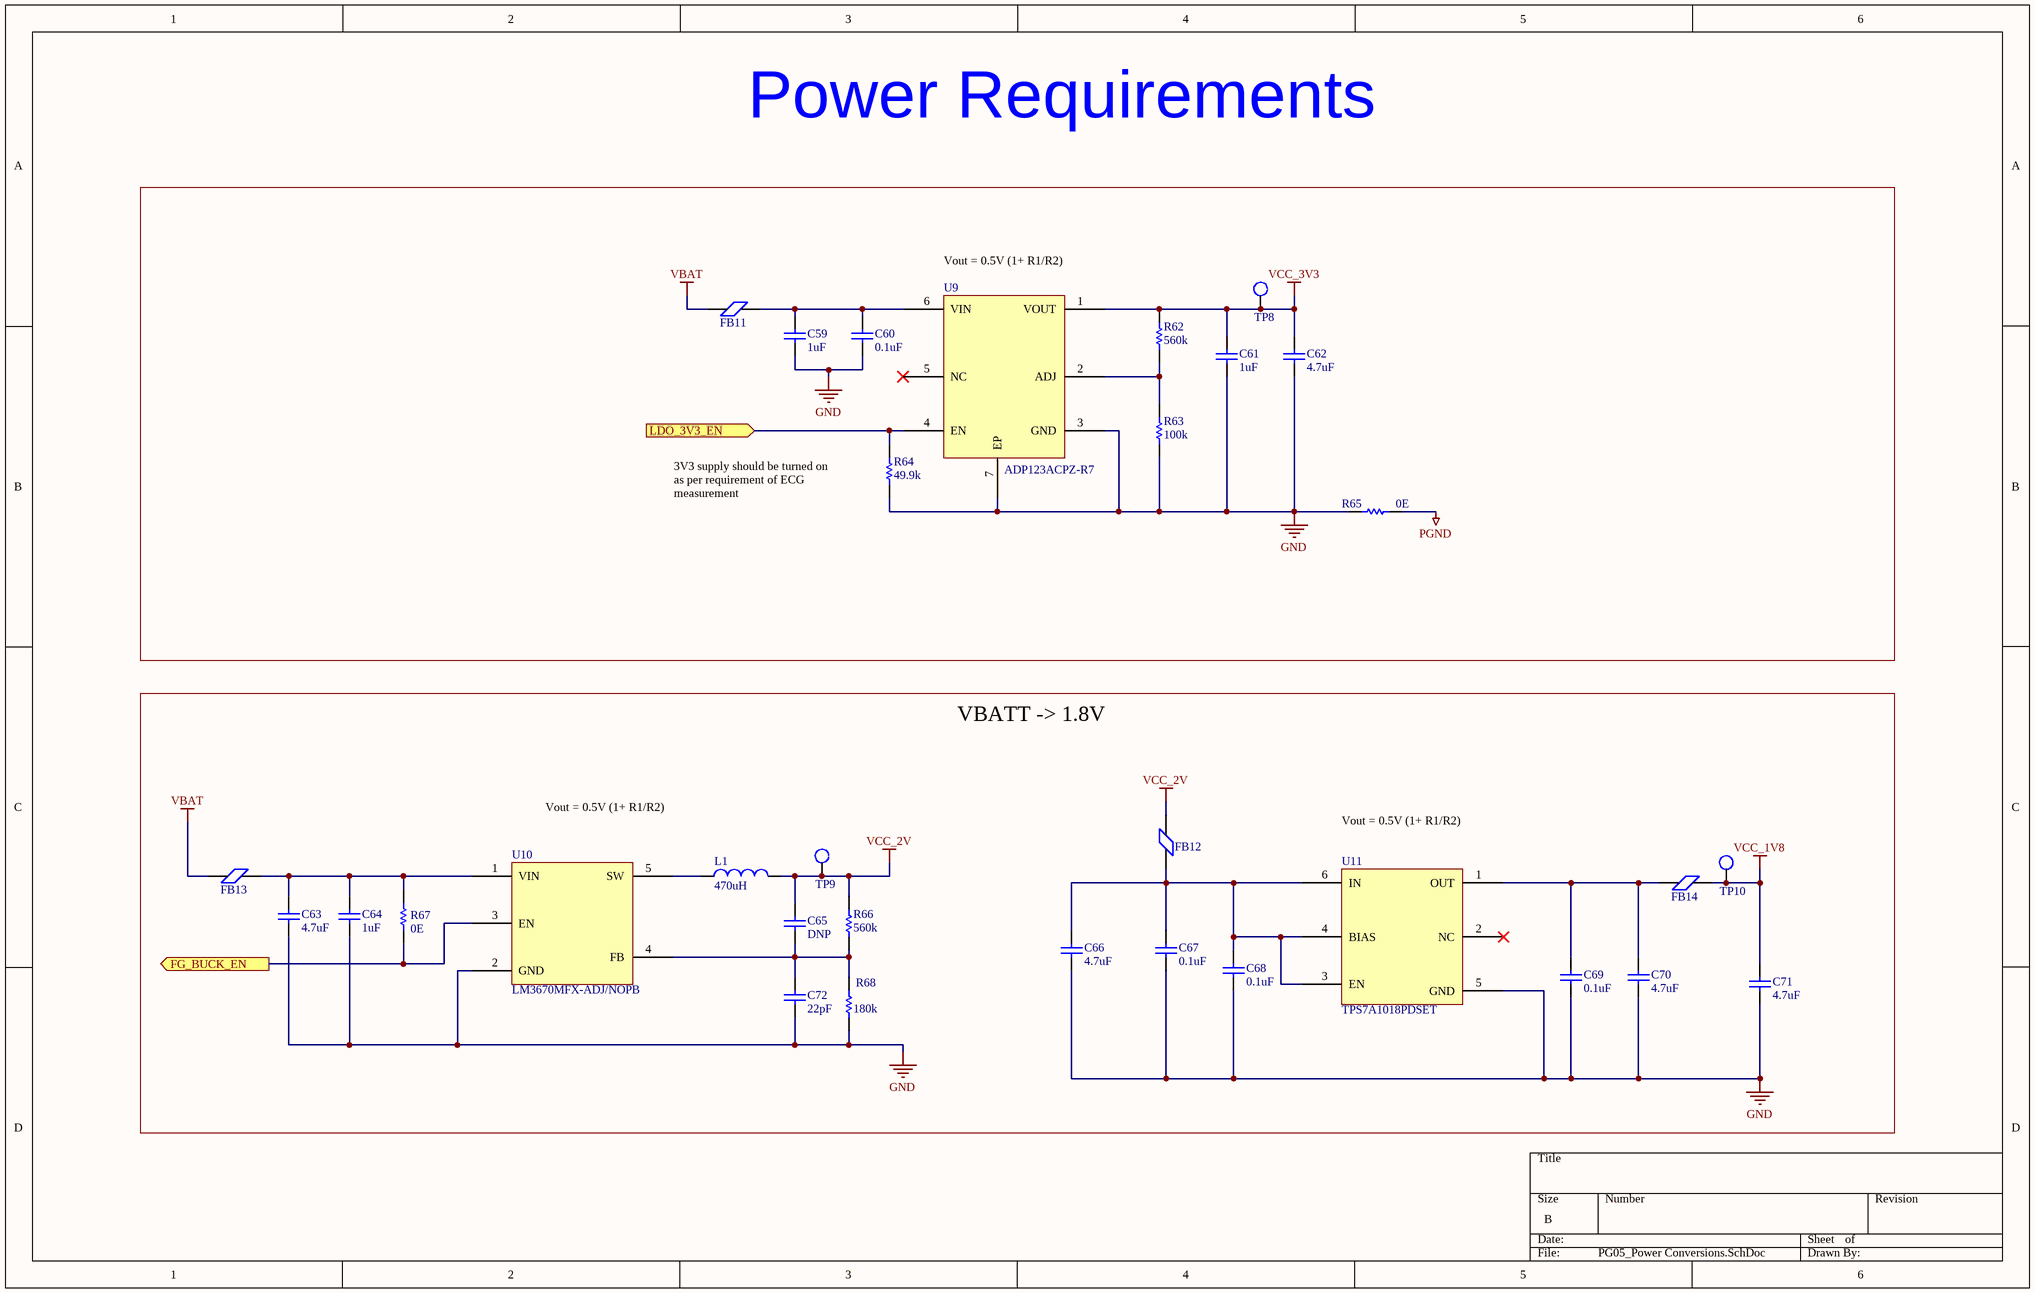
[diagram p4: PG05_Power Conversions.SchDoc]

### Parts
C59  1uF  [0805C]
C60  0.1uF  [0402C]
C61  1uF  [0805C]
C62  4.7uF  [0805C]
C63  4.7uF  [0805C]
C64  1uF  [0805C]
C65  DNP  [0402C]
C66  4.7uF  [0805C]
C67  0.1uF  [0402C]
C68  0.1uF  [0402C]
C69  0.1uF  [0402C]
C70  4.7uF  [0805C]
C71  4.7uF  [0805C]
C72  22pF  [0402C]
FB11  Ferrite Bead  [0402R]  (value not drawn)
FB12  Ferrite Bead  [0402R]  (value not drawn)
FB13  Ferrite Bead  [0402R]  (value not drawn)
FB14  Ferrite Bead  [0402R]  (value not drawn)
L1  470uH  [NR6028T3R0N]
R62  560k  [0402R]
R63  100k  [0402R]
R64  49.9k  [0402R]
R65  0E  [0402R]
R66  560k  [0402R]
R67  0E  [0402R]
R68  180k  [0402R]
TP8  Test_Point  [TP]  (value not drawn)
TP9  Test_Point  [TP]  (value not drawn)
TP10  Test_Point  [TP]  (value not drawn)
U9  ADP123ACPZ-R7  [ADP123ACPZ-R7]
U10  LM3670MFX-ADJ/NOPB  [LM3670MFX-ADJ/NOPB]
U11  TPS7A1018PDSET  [TPS7A1018PDSET]

### Blocks framed on the sheet
Vout = 0.5V (1+ R1/R2): C59-C62 FB11 R62-R65 TP8 U9
VBATT -> 1.8V: C63-C72 FB12-FB14 L1 R66-R68 TP9 TP10 U10 U11

### Ports
FG_BUCK_EN (out), LDO_3V3_EN (in)

### Nets
GND: C59.1 C60.1 C61.1 C62.1 C63.1 C64.1 C66.1 C67.1 C68.1 C69.1 C70.1 C71.1 C72.1 R63.1 R64.1 R65.1 R68.1 U9.3(GND) U9.7(EP) U10.2(GND) U11.5(GND)
PGND: R65.2
VBAT: FB11.1(VREF) FB13.1(VREF)
VCC_1V8: C71.2 FB14.2(VREF) TP10.1
VCC_2V: C65.1 FB12.2(VREF) L1.2 R66.2 TP9.1
VCC_3V3: C61.2 C62.2 R62.2 TP8.1 U9.1(VOUT)
NetC59_2: C59.2 C60.2 FB11.2(VREF) U9.6(VIN)
NetC63_2: C63.2 C64.2 FB13.2(VREF) R67.2 U10.1(VIN)
NetC65_2: C65.2 C72.2 R66.1 R68.2 U10.4(FB)
NetC66_2: C66.2 C67.2 C68.2 FB12.1(VREF) U11.3(EN) U11.4(BIAS) U11.6(IN)
NetC69_2: C69.2 C70.2 FB14.1(VREF) U11.1(OUT)
NetL1_1: L1.1 U10.5(SW)
NetR8_2: R64.2 U9.4(EN) ; port LDO_3V3_EN
NetR59_2: R67.1 U10.3(EN) ; port FG_BUCK_EN
NetR62_1: R62.1 R63.2 U9.2(ADJ)

Not connected (* = marked no-connect by the designer): U9 5(NC)*; U11 2(NC)*

### Notes on the sheet
- Power Requirements
- 3V3 supply should be turned on as per requirement of ECG measurement
- Vout = 0.5V (1+ R1/R2)

### Library data of the parts
C59 C61 C64 = CAP_0805_1uF_25V: as C17 on sheet PG02_PPG; Package: 0805; Value: 1uF
C60 C67-C69 = CAP_0402_0.1uF_50V: as C2 on sheet PG01_BLE Module; Package: 0402; Value: 0.1uF
C62 C63 C66 C70 C71 = CAP_0805_4.7uF_16V: as C25 on sheet PG02_PPG; Package: 0805; Value: 4.7uF
C65 = CAP_0402_DNP: CAP CER DNP 0402; MFR: Generic; MPN: Generic; Package: 0402; Value: DNP
C72 = CAP_0402_22pF: CAP CER 22PF 50V C0G 0402; MFR: Generic; Alternate MFR: TDK Corporation; Alternate MPN: C1005C0G1H220J050BA; MPN: Generic; Package: 0402; Value: 22pF
FB11-FB14 = Ferrite Bead: as FB1 on sheet PG01_BLE Module; Package: 0402
L1 = IND_470uH: FIXED IND 470UH 105MA 14.3OHM SM; MFR: Bourns; MPN: SDR0302-471KL; Package: 0302; Alternate MFR: *; Alternate MPN: *; Value: 470uH
R62 R66 = RES_0402_560k: RES 560K OHM 1% 1/16W 0402; MFR: Generic; Alternate MFR: YAGEO; Alternate MPN: RC0402FR-07560KL; MPN: Generic; Package: 0402; Value: 560k
R63 = RES_0402_100k: RES 100K OHM 1% 1/16W 0402; MFR: Generic; Alternate MFR: YAGEO; Alternate MPN: RC0402FR-07100KP; MPN: Generic; Package: 0402; Value: 100k
R64 = RES_0402_49.9k: as R40 on sheet PG03_ECG; MPN: Generic; Package: 0402; Value: 49.9k
R65 R67 = RES_0402_0E: as R2 on sheet PG01_BLE Module; MPN: Generic; Package: 0402; Value: 0E
R68 = RES_0402_180k: RES 180K OHM 1% 1/16W 0402; MFR: Generic; Alternate MFR: YAGEO; Alternate MPN: RC0402FR-07180KL; MPN: Generic; Package: 0402; Value: 180k
U9 = LDO_ADP123ACPZ-R7: IC REG LIN POS ADJ 300MA 6LFCSP; MFR: Analog Devices; MPN: ADP123ACPZ-R7; Package: 6-LFCSP-UD (2x2)
U10 = Buck_LM3670MFX-ADJ/NOPB: IC REG BUCK ADJ 350MA SOT23-5; MFR: Texas Instruments; MPN: LM3670MFX-ADJ/NOPB; Package: SOT-23-5
U11 = LDO_TPS7A1018PDSET: IC REG LINEAR 1.8V 300MA 6WSON; MFR: TI; MPN: TPS7A1018PDSET; Package: 6-WSON (1.5x1.5)

## Sheet PG06_Nuerosky.SchDoc
size B
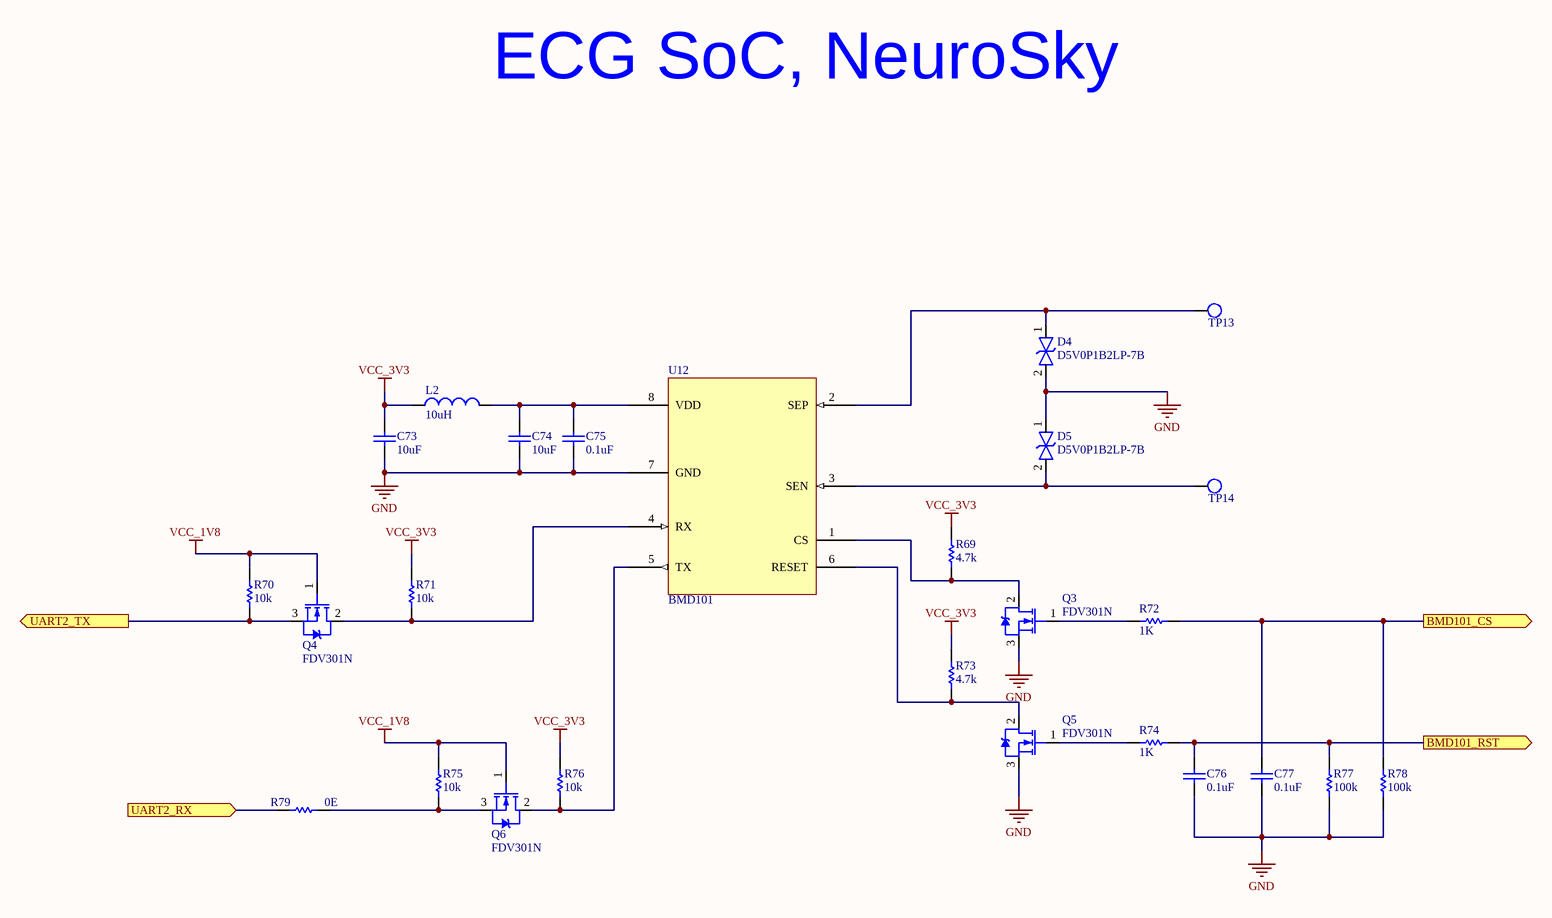
[diagram p5: PG06_Nuerosky.SchDoc]

### Parts
C73  10uF  [0805C]
C74  10uF  [0805C]
C75  0.1uF  [0402C]
C76  0.1uF  [0402C]
C77  0.1uF  [0402C]
D4  D5V0P1B2LP-7B  [D5V0P1B2LP-7B]
D5  D5V0P1B2LP-7B  [D5V0P1B2LP-7B]
L2  10uH  [NR6028T3R0N]
Q3  FDV301N  [SOT_23]
Q4  FDV301N  [SOT_23]
Q5  FDV301N  [SOT_23]
Q6  FDV301N  [SOT_23]
R69  4.7k  [0402R]
R70  10k  [0402R]
R71  10k  [0402R]
R72  1K  [0402R]
R73  4.7k  [0402R]
R74  1K  [0402R]
R75  10k  [0402R]
R76  10k  [0402R]
R77  100k  [0402R]
R78  100k  [0402R]
R79  0E  [0402R]
TP13  Test_Point  [TP_SMD]  (value not drawn)
TP14  Test_Point  [TP_SMD]  (value not drawn)
U12  BMD101  [BMD101]

### Ports
BMD101_CS (out), BMD101_RST (out), UART2_RX (in), UART2_TX (out)

### Nets
GND: C73.1 C74.1 C75.1 C76.1 C77.1 D4.2 D5.1 Q3.3(S) Q5.3(S) R77.1 R78.1 U12.7(GND)
VCC_1V8: Q4.1(G) Q6.1(G) R70.2 R75.2
VCC_3V3: C73.2 L2.1 R69.2 R71.2 R73.2 R76.2
BMD101_CS: C77.2 R72.2 R78.2 ; port BMD101_CS
BMD101_RST: C76.2 R74.2 R77.2 ; port BMD101_RST
UART2_RX: R79.1 ; port UART2_RX
UART2_TX: Q4.3(S) R70.1 ; port UART2_TX
NetC74_2: C74.2 C75.2 L2.2 U12.8(VDD)
NetD4_1: D4.1 TP13.1 U12.2(SEP)
NetD5_2: D5.2 TP14.1 U12.3(SEN)
NetQ3_1: Q3.1(G) R72.1
NetQ3_2: Q3.2(D) R69.1 U12.1(CS)
NetQ4_2: Q4.2(D) R71.1 U12.4(RX)
NetQ5_1: Q5.1(G) R74.1
NetQ5_2: Q5.2(D) R73.1 U12.6(RESET)
NetQ6_2: Q6.2(D) R76.1 U12.5(TX)
NetQ6_3: Q6.3(S) R75.1 R79.2

### Notes on the sheet
- ECG SoC, NeuroSky

### Library data of the parts
C73 C74 = CAP_0805_10uF_16V: as C1 on sheet PG01_BLE Module; Package: 0805; Value: 10uF
C75-C77 = CAP_0402_0.1uF_50V: as C2 on sheet PG01_BLE Module; Package: 0402; Value: 0.1uF
D4 D5 = TVS_D5V0P1B2LP-7B: as D1 on sheet PG03_ECG; MPN: D5V0P1B2LP-7B; Package: X1-DFN1006-2
L2 = IND_10uH: WE-PMI POWER MULTILAYER INDUCTOR; MFR: Würth Elektronik; MPN: 74479777310A; Package: 0805; Alternate MFR: *; Alternate MPN: *; Value: 10uH
Q3-Q6 = NMOS_FDV301N: MOSFET N-CH 25V 220MA SOT23; MFR: onsemi; ComponentLink1Description: Manufacturer Link; ComponentLink1URL: http://www.irf.com/; MPN: FDV301N; Package: SOT23
R69 R73 = RES_0402_4.7k: as R3 on sheet PG01_BLE Module; MPN: Generic; Package: 0402; Value: 4.7k
R70 R71 R75 R76 = RES_0402_10k: RES SMD 10K OHM 1% 1/16W 0402; MFR: Generic; Alternate MFR: YAGEO; Alternate MPN: AF0402FR-0710KL; MPN: Generic; Package: 0402; Value: 10k
R72 R74 = RES_0402_1k: as R1 on sheet PG01_BLE Module; MPN: Generic; Package: 0402; Value: 1K
R77 R78 = RES_0402_100k: as R63 on sheet PG05_Power Conversions; MPN: Generic; Package: 0402; Value: 100k
R79 = RES_0402_0E: as R2 on sheet PG01_BLE Module; MPN: Generic; Package: 0402; Value: 0E
TP13 TP14 = Test_Point_1
U12 = Bio-Signal_SoC_BMD101: Mixed Signal SoC with Integrated AFE, DSP functions and UART; MFR: NeuroSky; MPN: BMD101

## Nets that join several sheets
GND: PG01_BLE Module (16 pins), PG02_PPG (23 pins), PG03_ECG (19 pins), PG04_Battery Charging (12 pins), PG05_Power Conversions (21 pins), PG06_Nuerosky (12 pins)
PGND: PG02_PPG (C27.1 C28.1 U4.4), PG05_Power Conversions (R65.2)
VBAT: PG04_Battery Charging (6 pins), PG05_Power Conversions (FB11.1 FB13.1)
VCC_1V8: PG01_BLE Module (FB1.2), PG02_PPG (FB2.2), PG03_ECG (FB6.2), PG04_Battery Charging (R53.2), PG05_Power Conversions (C71.2 FB14.2 TP10.1), PG06_Nuerosky (Q4.1 Q6.1 R70.2 R75.2)
VCC_3V3: PG02_PPG (FB3.2), PG05_Power Conversions (5 pins), PG06_Nuerosky (6 pins)
ACCEL_INT: PG01_BLE Module (R14.2), PG02_PPG (C29.2 R27.2 U3.19)
ACCEL_INT2: PG01_BLE Module (R16.2), PG02_PPG (R22.2)
BMD101_CS: PG01_BLE Module (R11.2), PG06_Nuerosky (C77.2 R72.2 R78.2)
BMD101_RST: PG01_BLE Module (R13.2), PG06_Nuerosky (C76.2 R74.2 R77.2)
NetC7_2: PG01_BLE Module (C7.2 U1.19), PG04_Battery Charging (R53.1 R54.1)
NetC8_2: PG01_BLE Module (C8.2 U1.12), PG04_Battery Charging (R60.2)
NetC9_2: PG01_BLE Module (C9.2 U1.20), PG03_ECG (R48.1)
NetC23_2: PG01_BLE Module (R17.1), PG02_PPG (C23.2 U3.6)
NetC24_2: PG01_BLE Module (R15.1), PG02_PPG (C24.2 U3.1)
NetC45_2: PG01_BLE Module (R12.1), PG03_ECG (C45.2 U6.6)
NetR3_1: PG01_BLE Module (R3.1 U1.13), PG04_Battery Charging (R57.2)
NetR4_1: PG01_BLE Module (R4.1 U1.18), PG04_Battery Charging (R58.2)
NetR8_2: PG01_BLE Module (R8.2), PG05_Power Conversions (R64.2 U9.4)
NetR9_1: PG01_BLE Module (R9.1 U1.9), PG02_PPG (R24.2 R32.1), PG03_ECG (R45.1)
NetR10_1: PG01_BLE Module (R10.1 U1.6), PG02_PPG (R28.2 R33.1), PG03_ECG (R47.1)
NetR59_2: PG04_Battery Charging (R59.2), PG05_Power Conversions (R67.1 U10.3)
UART2_RX: PG01_BLE Module (U1.26), PG06_Nuerosky (R79.1)
UART2_TX: PG01_BLE Module (R5.2), PG06_Nuerosky (Q4.3 R70.1)

## Assembly variants
NeuroSky_Chipset_ECG: all parts fitted
ECG AFE_w/_Sensor Hub: all parts fitted